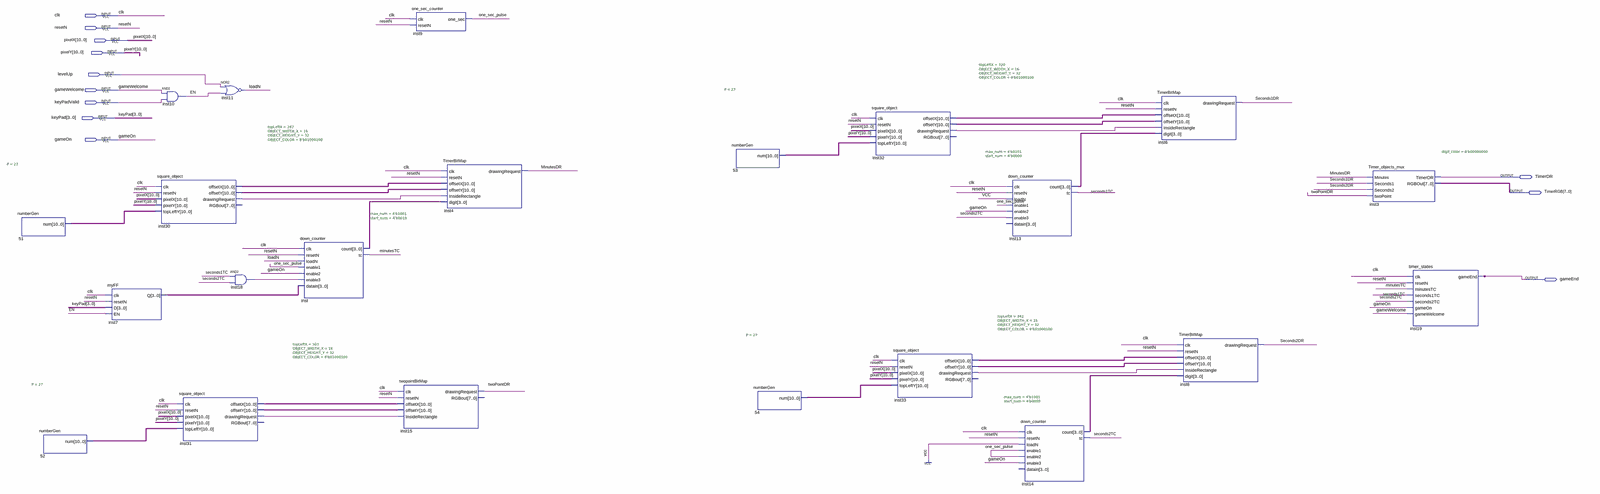
[diagram p0: schematic sheet, whole]
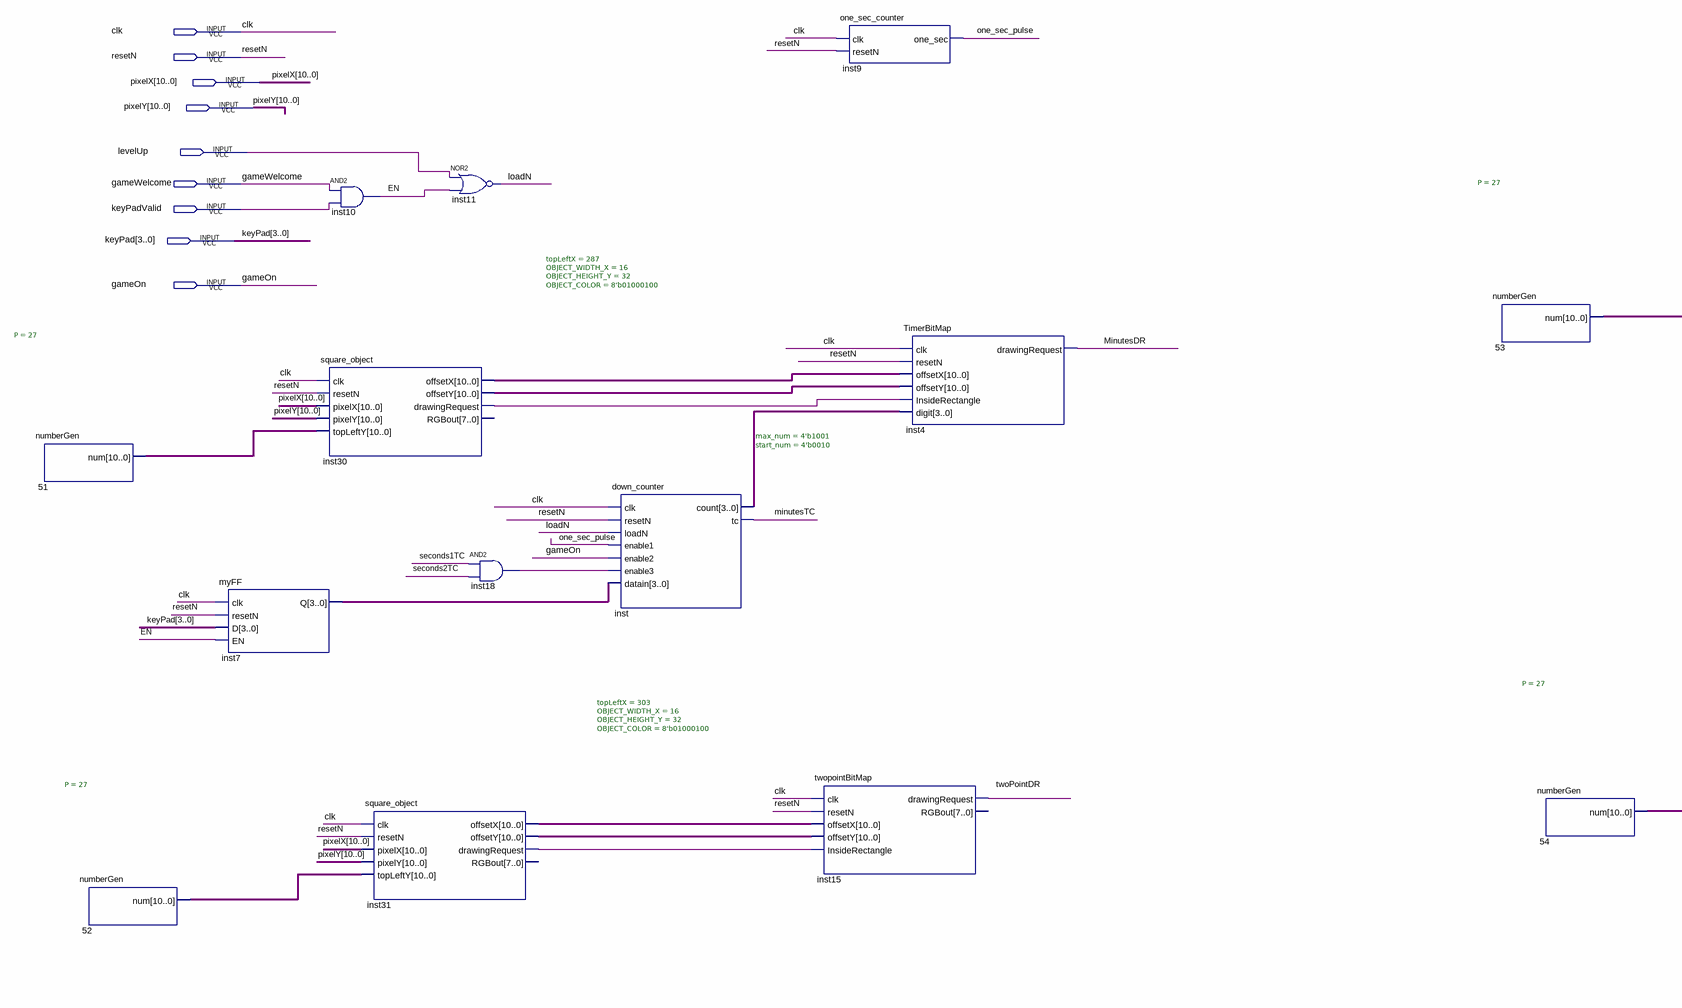
[diagram p1: schematic sheet, left part]
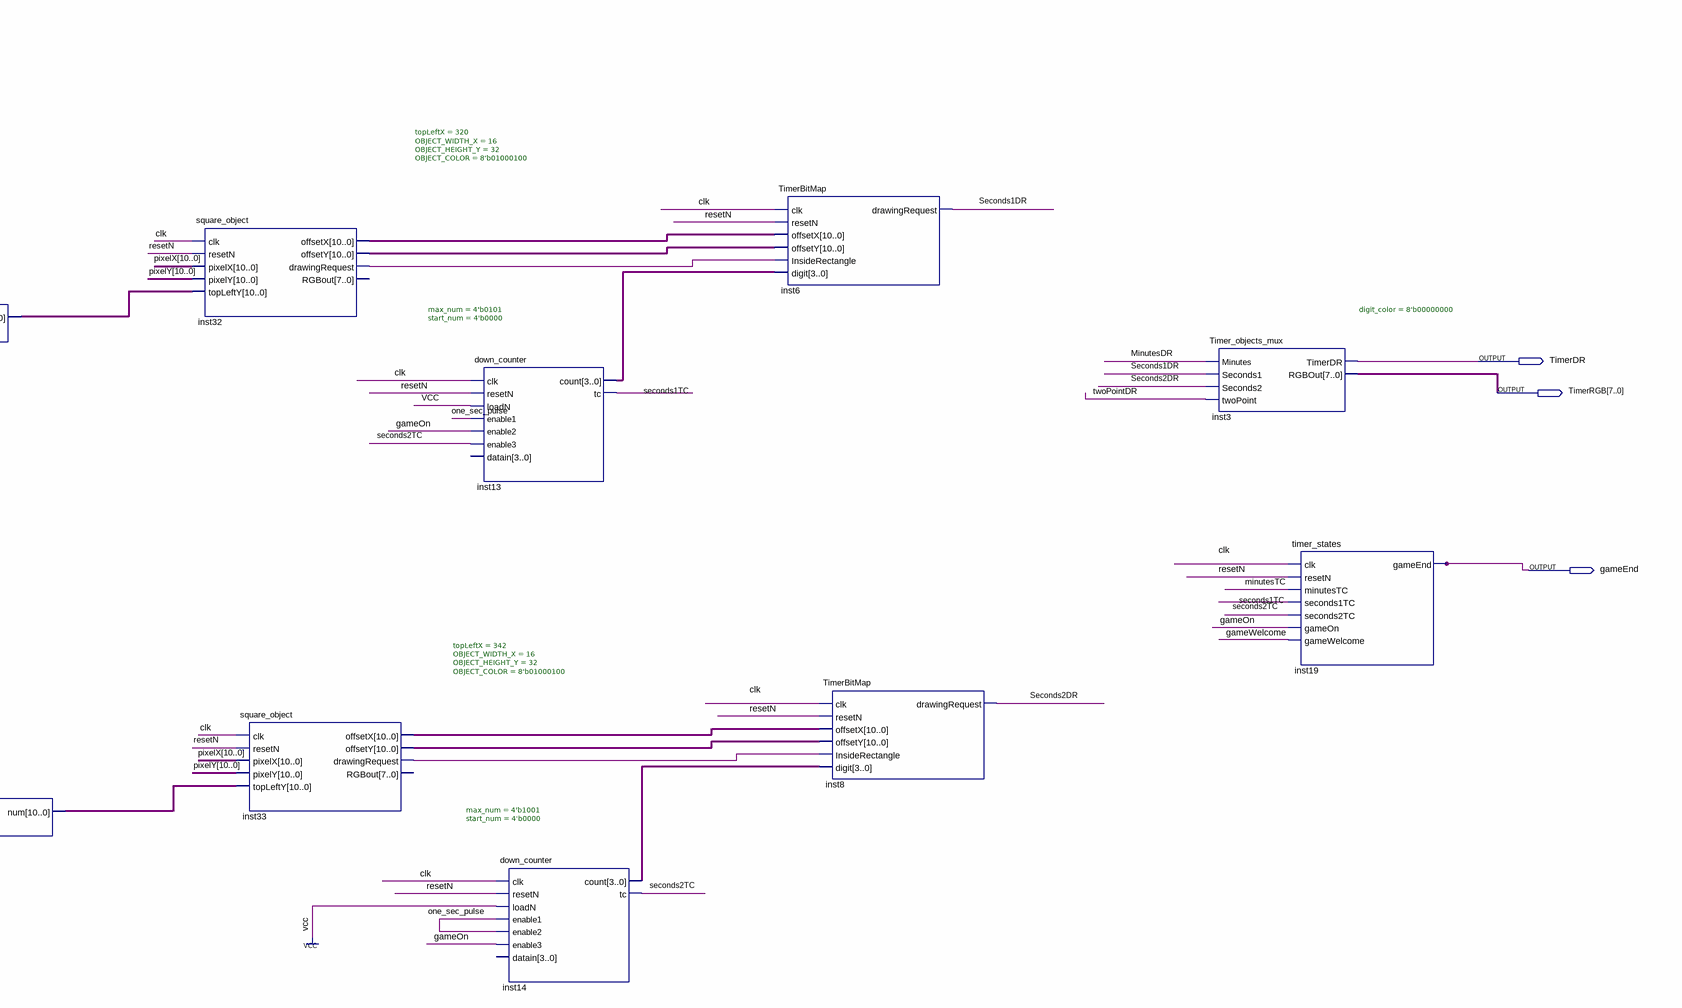
[diagram p2: schematic sheet, right part]
// Quartus schematic TOP_VGA_DEMO_KBD_new.bdf as structural Verilog: 22 symbols, 12 pins
module TOP_VGA_DEMO_KBD_new (
  input  clk,
  input  resetN,
  input  [10:0] pixelX,
  input  [10:0] pixelY,
  input  levelUp,
  input  gameWelcome,
  input  keyPadValid,
  input  [3:0] keyPad,
  input  gameOn,
  output TimerDR,
  output [7:0] TimerRGB,
  output gameEnd
);

  wire EN, inst18_out, inst30_drawingrequest, inst31_drawingrequest, inst32_drawingrequest,
       inst33_drawingrequest, loadN, MinutesDR, minutesTC, one_sec_pulse, Seconds1DR, seconds1TC, Seconds2DR,
       seconds2TC, twoPointDR;
  wire [3:0] inst7_q, inst13_count, inst14_count, inst_count;
  wire [10:0] inst30_offsetx, inst30_offsety, inst31_offsetx, inst31_offsety, inst32_offsetx, inst32_offsety,
       inst33_offsetx, inst33_offsety, n51_num, n52_num, n53_num, n54_num;

  numberGen #(.P(27)) u_51 (.num(n51_num));
  numberGen #(.P(27)) u_52 (.num(n52_num));
  myFF inst7 (.clk(clk), .resetN(resetN), .D(keyPad), .EN(EN), .Q(inst7_q));
  and inst10 (EN, gameWelcome, keyPadValid);
  square_object #(.topLeftX(287), .OBJECT_WIDTH_X(16), .OBJECT_HEIGHT_Y(32), .OBJECT_COLOR(8'b01000100)) inst30 (
    .clk(clk), .resetN(resetN), .pixelX(pixelX), .pixelY(pixelY), .topLeftY(n51_num),
    .offsetX(inst30_offsetx), .offsetY(inst30_offsety), .drawingRequest(inst30_drawingrequest));  // open: RGBout
  square_object #(.topLeftX(303), .OBJECT_WIDTH_X(16), .OBJECT_HEIGHT_Y(32), .OBJECT_COLOR(8'b01000100)) inst31 (
    .clk(clk), .resetN(resetN), .pixelX(pixelX), .pixelY(pixelY), .topLeftY(n52_num),
    .offsetX(inst31_offsetx), .offsetY(inst31_offsety), .drawingRequest(inst31_drawingrequest));  // open: RGBout
  nor inst11 (loadN, levelUp, EN);
  and inst18 (inst18_out, seconds1TC, seconds2TC);
  down_counter #(.max_num(4'b1001), .start_num(4'b0010)) inst (
    .clk(clk), .resetN(resetN), .loadN(loadN), .enable1(one_sec_pulse), .enable2(gameOn),
    .enable3(inst18_out), .datain(inst7_q), .count(inst_count), .tc(minutesTC));
  one_sec_counter inst9 (.clk(clk), .resetN(resetN), .one_sec(one_sec_pulse));
  twopointBitMap inst15 (
    .clk(clk), .resetN(resetN), .offsetX(inst31_offsetx), .offsetY(inst31_offsety),
    .InsideRectangle(inst31_drawingrequest), .drawingRequest(twoPointDR));  // open: RGBout
  TimerBitMap inst4 (
    .clk(clk), .resetN(resetN), .offsetX(inst30_offsetx), .offsetY(inst30_offsety),
    .InsideRectangle(inst30_drawingrequest), .digit(inst_count), .drawingRequest(MinutesDR));
  numberGen #(.P(27)) u_53 (.num(n53_num));
  numberGen #(.P(27)) u_54 (.num(n54_num));
  square_object #(.topLeftX(320), .OBJECT_WIDTH_X(16), .OBJECT_HEIGHT_Y(32), .OBJECT_COLOR(8'b01000100)) inst32 (
    .clk(clk), .resetN(resetN), .pixelX(pixelX), .pixelY(pixelY), .topLeftY(n53_num),
    .offsetX(inst32_offsetx), .offsetY(inst32_offsety), .drawingRequest(inst32_drawingrequest));  // open: RGBout
  square_object #(.topLeftX(342), .OBJECT_WIDTH_X(16), .OBJECT_HEIGHT_Y(32), .OBJECT_COLOR(8'b01000100)) inst33 (
    .clk(clk), .resetN(resetN), .pixelX(pixelX), .pixelY(pixelY), .topLeftY(n54_num),
    .offsetX(inst33_offsetx), .offsetY(inst33_offsety), .drawingRequest(inst33_drawingrequest));  // open: RGBout
  down_counter #(.max_num(4'b0101), .start_num(4'b0000)) inst13 (
    .clk(clk), .resetN(resetN), .loadN(1'b1), .enable1(one_sec_pulse), .enable2(gameOn),
    .enable3(seconds2TC), .count(inst13_count), .tc(seconds1TC));  // open: datain
  down_counter #(.max_num(4'b1001), .start_num(4'b0000)) inst14 (
    .clk(clk), .resetN(resetN), .loadN(1'b1), .enable1(one_sec_pulse), .enable2(one_sec_pulse),
    .enable3(gameOn), .count(inst14_count), .tc(seconds2TC));  // open: datain
  TimerBitMap inst6 (
    .clk(clk), .resetN(resetN), .offsetX(inst32_offsetx), .offsetY(inst32_offsety),
    .InsideRectangle(inst32_drawingrequest), .digit(inst13_count), .drawingRequest(Seconds1DR));
  TimerBitMap inst8 (
    .clk(clk), .resetN(resetN), .offsetX(inst33_offsetx), .offsetY(inst33_offsety),
    .InsideRectangle(inst33_drawingrequest), .digit(inst14_count), .drawingRequest(Seconds2DR));
  Timer_objects_mux #(.digit_color(8'b00000000)) inst3 (
    .Minutes(MinutesDR), .Seconds1(Seconds1DR), .Seconds2(Seconds2DR), .twoPoint(twoPointDR),
    .TimerDR(TimerDR), .RGBOut(TimerRGB));
  timer_states inst19 (
    .clk(clk), .resetN(resetN), .minutesTC(minutesTC), .seconds1TC(seconds1TC), .seconds2TC(seconds2TC),
    .gameOn(gameOn), .gameWelcome(gameWelcome), .gameEnd(gameEnd));
endmodule
